# EAGLE design radiosonde_lite_final (EAGLE 9.6.2)
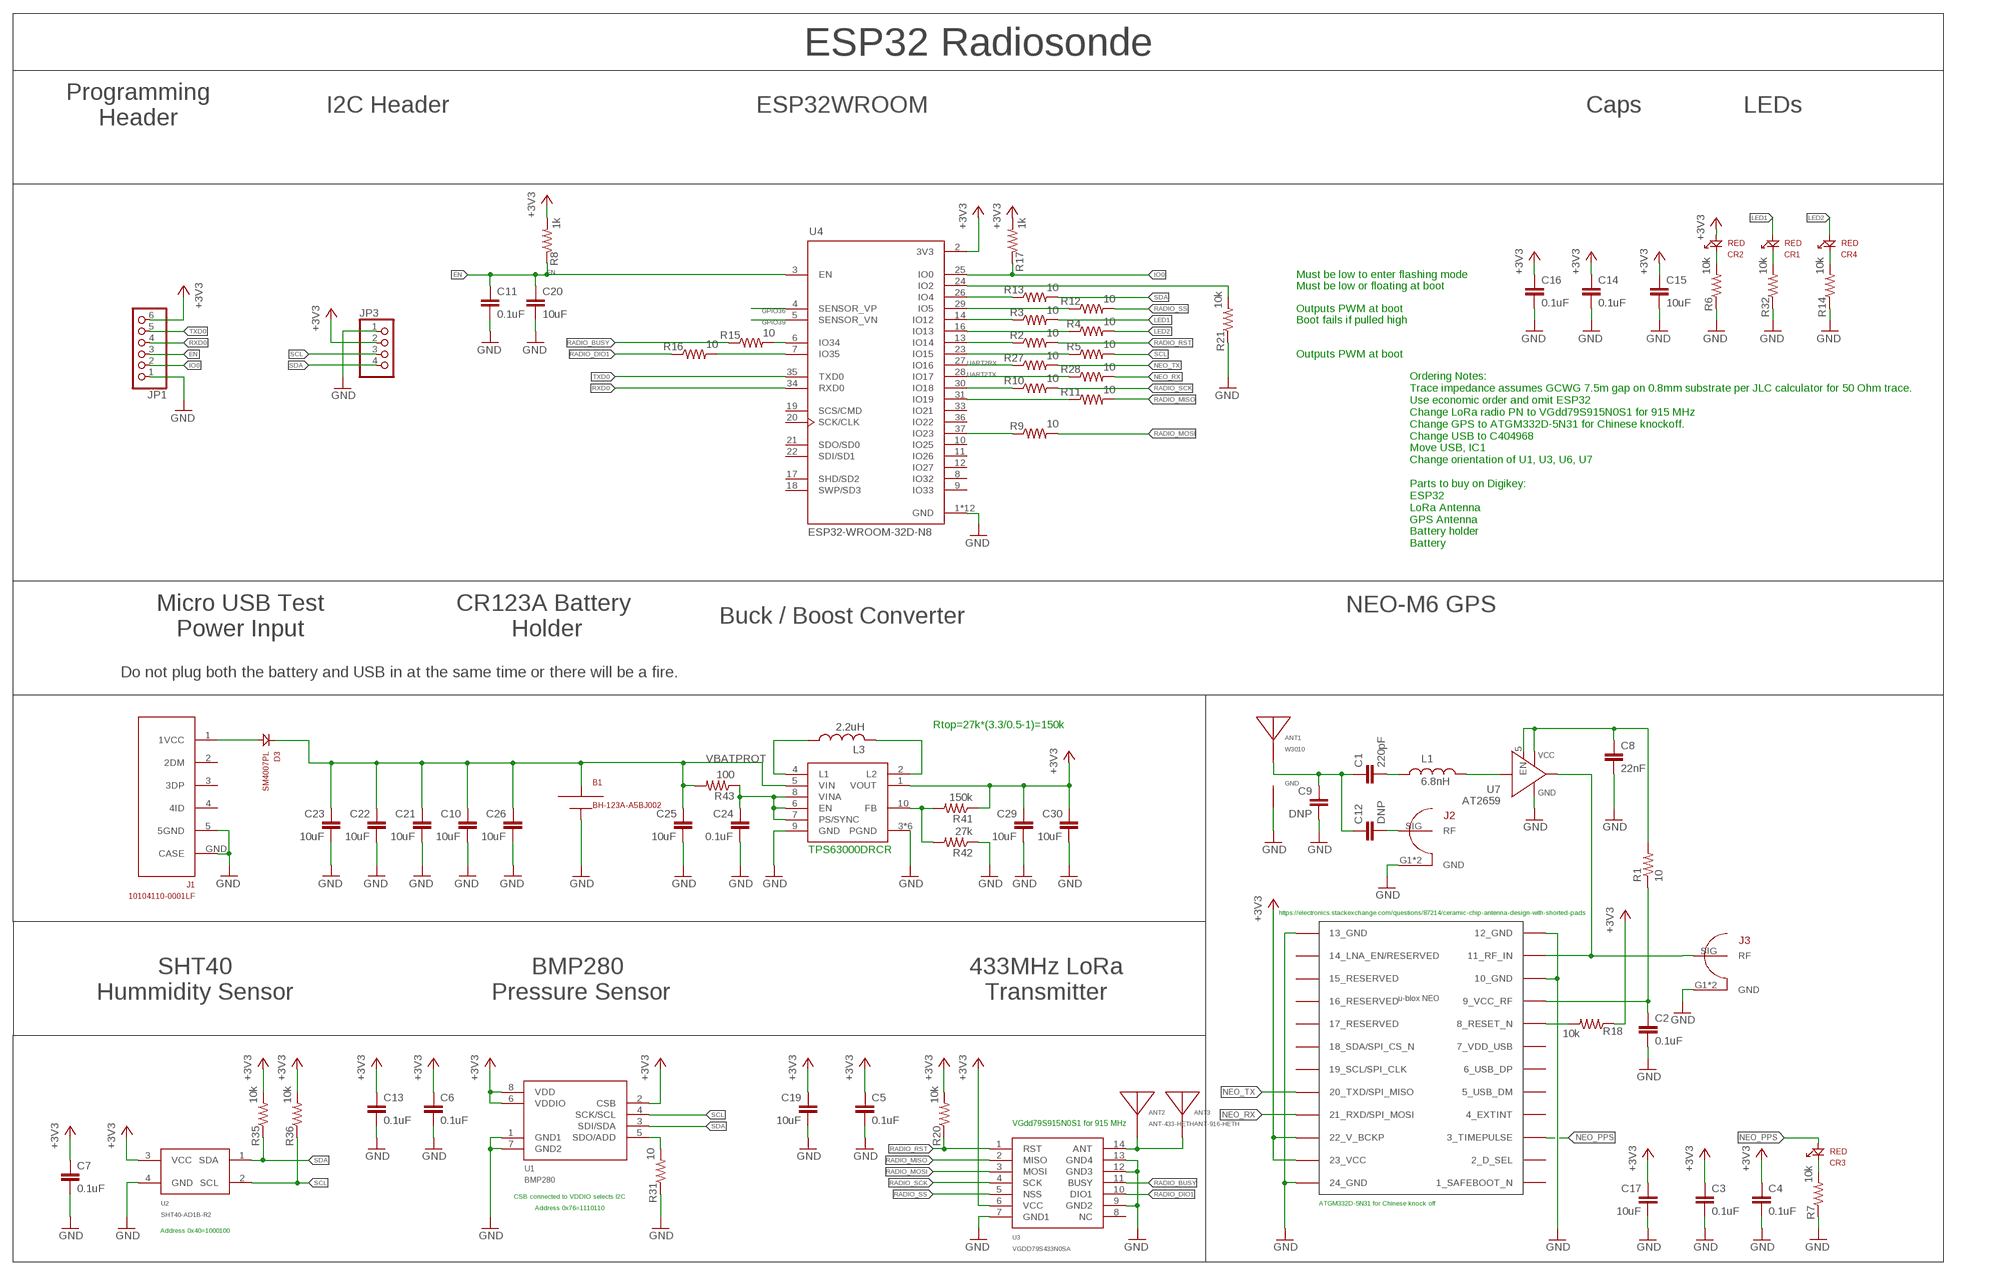
[diagram p0: schematic, sheet 1]

## Parts
ANT1  W3010  [W3010]
ANT2  ANT-433-HETH  [ANT-433-HETH]
ANT3  ANT-916-HETH  [ANT-916-HETH]
B1  BH-123A-A5BJ002  [BH-123A-A5BJ002]
C1  220pF  0402_CAPACITOR  [0402_INDUCTOR]
C2  0.1uF  0402_CAPACITOR  [0402_INDUCTOR]
C3  0.1uF  0402_CAPACITOR  [0402_INDUCTOR]
C4  0.1uF  0402_CAPACITOR  [0402_INDUCTOR]
C5  0.1uF  0402_CAPACITOR  [0402_INDUCTOR]
C6  0.1uF  0402_CAPACITOR  [0402_INDUCTOR]
C7  0.1uF  0402_CAPACITOR  [0402_INDUCTOR]
C8  22nF  0402_CAPACITOR  [0402_INDUCTOR]
C9  DNP  0402_CAPACITOR  [0402_INDUCTOR]
C10  10uF  0603_CAPACITOR  [0603]
C11  0.1uF  0402_CAPACITOR  [0402_INDUCTOR]
C12  DNP  0402_CAPACITOR  [0402_INDUCTOR]
C13  0.1uF  0402_CAPACITOR  [0402_INDUCTOR]
C14  0.1uF  0402_CAPACITOR  [0402_INDUCTOR]
C15  10uF  0603_CAPACITOR  [0603]
C16  0.1uF  0402_CAPACITOR  [0402_INDUCTOR]
C17  10uF  0603_CAPACITOR  [0603]
C19  10uF  0603_CAPACITOR  [0603]
C20  10uF  0603_CAPACITOR  [0603]
C21  10uF  0603_CAPACITOR  [0603]
C22  10uF  0603_CAPACITOR  [0603]
C23  10uF  0603_CAPACITOR  [0603]
C24  0.1uF  0603_CAPACITOR  [0603]
C25  10uF  0603_CAPACITOR  [0603]
C26  10uF  0603_CAPACITOR  [0603]
C29  10uF  0603_CAPACITOR  [0603]
C30  10uF  0603_CAPACITOR  [0603]
CR1  RED  150060RS75000  [0603_DIODE]
CR2  RED  150060RS75000  [0603_DIODE]
CR3  RED  150060RS75000  [0603_DIODE]
CR4  RED  150060RS75000  [0603_DIODE]
D3  SM4007PL  [SOD123(AK)]
IC1  NEO-M8  [NEO-M8]
J1  10104110-0001LF  [MICRO_USB]
J2  CONUFL001-SMD  [U.FL]
J3  CONUFL001-SMD  [U.FL]
JP1  PINHD-1X6  [1X06]
JP3  PINHD-1X4  [1X04]
L1  6.8nH  0402_INDUCTOR  [0402_INDUCTOR]
L3  2.2uH  CY43-2.2UH  [CY43]
R1  10  0402_RESISTOR  [R0402]
R2  10  0402_RESISTOR  [R0402]
R3  10  0402_RESISTOR  [R0402]
R4  10  0402_RESISTOR  [R0402]
R5  10  0402_RESISTOR  [R0402]
R6  10k  0402_RESISTOR  [R0402]
R7  10k  0402_RESISTOR  [R0402]
R8  1k  0402_RESISTOR  [R0402]
R9  10  0402_RESISTOR  [R0402]
R10  10  0402_RESISTOR  [R0402]
R11  10  0402_RESISTOR  [R0402]
R12  10  0402_RESISTOR  [R0402]
R13  10  0402_RESISTOR  [R0402]
R14  10k  0402_RESISTOR  [R0402]
R15  10  0402_RESISTOR  [R0402]
R16  10  0402_RESISTOR  [R0402]
R17  1k  0402_RESISTOR  [R0402]
R18  10k  0402_RESISTOR  [R0402]
R20  10k  0402_RESISTOR  [R0402]
R21  10k  0402_RESISTOR  [R0402]
R27  10  0402_RESISTOR  [R0402]
R28  10  0402_RESISTOR  [R0402]
R31  10  0402_RESISTOR  [R0402]
R32  10k  0402_RESISTOR  [R0402]
R35  10k  0402_RESISTOR  [R0402]
R36  10k  0402_RESISTOR  [R0402]
R41  150k  0603_RESISTOR  [0603]
R42  27k  0603_RESISTOR  [0603]
R43  100  0603_RESISTOR  [0603]
U1  BMP280  [BME280]
U2  SHT40-AD1B-R2  [SHT40]
U3  VGDD79S433N0SA  [VGDD79S433N0SA]
U4  ESP32-WROOM-32D-N8  ESP32-WROOM-32D  [MODULE_ESP32-WROOM-32D]
U6  TPS63000DRCR  [S-PVSON-N10]
U7  AT2659  [6DFN-1X1.6]

## Nets
+3V3: C3.P$1 C4.P$1 C5.P$1 C6.P$1 C7.P$1 C13.P$1 C14.P$1 C15.1 C16.P$1 C17.1 C19.1 C29.1 C30.1 CR2.A IC1.22(22_V_BCKP) IC1.23(23_VCC) JP1.6 JP3.2 R8.2 R17.2 R18.1 R20.2 R35.2 R36.2 R41.1 U1.2(CSB) U1.6(VDDIO) U1.8(VDD) U2.3(VCC) U3.6(VCC) U4.2(3V3) U6.1(VOUT)
EN: C11.P$1 C20.1 JP1.3 R8.1 U4.3(EN)
GND: ANT1.P$1(GND) ANT1.P$3(GND) B1.N(-) C2.P$2 C3.P$2 C4.P$2 C5.P$2 C6.P$2 C7.P$2 C8.P$2 C9.P$2 C10.2 C11.P$2 C13.P$2 C14.P$2 C15.2 C16.P$2 C17.2 C19.2 C20.2 C21.2 C22.2 C23.2 C24.2 C25.2 C26.2 C29.2 C30.2 IC1.10(10_GND) IC1.12(12_GND) IC1.13(13_GND) IC1.24(24_GND) J1.5(5GND) J1.GND(CASE) J2.G1(GND) J2.G2(GND) J3.G1(GND) J3.G2(GND) JP1.1 JP3.1 R6.1 R7.1 R14.1 R21.1 R31.1 R32.1 R42.1 U1.1(GND1) U1.7(GND2) U2.4(GND) U3.7(GND1) U3.9(GND2) U3.12(GND3) U3.13(GND4) U4.1(GND) U4.15(GND) U4.38(GND) U4.39_1(GND) U4.39_2(GND) U4.39_3(GND) U4.39_4(GND) U4.39_5(GND) U4.39_6(GND) U4.39_7(GND) U4.39_8(GND) U4.39_9(GND) U6.3(PGND) U6.9(GND) U6.PG1(PGND) U6.PG2(PGND) U6.PG3(PGND) U6.PG4(PGND) U6.PG(PGND) U7.1(GND) U7.2(GND)
GPIO36: U4.4(SENSOR_VP)
GPIO39: U4.5(SENSOR_VN)
GPS_VCC_RF: C8.P$1 R1.2 U7.4(VS) U7.5(EN)
IO0: JP1.2 R17.1 U4.25(IO0)
LED1: CR1.A R3.2
LED2: CR4.A R4.2
N$1: R3.1 U4.14(IO12)
N$2: IC1.8(8_RESET_N) R18.2
N$3: R10.1 U4.30(IO18)
N$4: C1.P$2 L1.P$1
N$5: R16.2 U4.7(IO35)
N$6: L1.P$2 U7.3(RF_IN)
N$7: CR2.K R6.2
N$8: R11.1 U4.31(IO19)
N$9: R4.1 U4.16(IO13)
N$10: R31.2 U1.5(SDO/ADD)
N$11: ANT2.IN1 ANT2.IN2 ANT3.IN1 U3.14(ANT)
N$12: CR3.K R7.2
N$13: R5.1 U4.23(IO15)
N$14: ANT1.P$2(ANT) C1.P$1 C9.P$1 C12.P$1
N$15: CR1.K R32.2
N$16: R12.1 U4.29(IO5)
N$17: R13.1 U4.26(IO4)
N$18: CR4.K R14.2
N$19: R15.2 U4.6(IO34)
N$20: R9.1 U4.37(IO23)
N$25: D3.A J1.1(1VCC)
N$26: C2.P$1 IC1.9(9_VCC_RF) R1.1
N$28: R21.2 U4.24(IO2)
N$29: R2.1 U4.13(IO14)
N$30: C12.P$2 J2.SIG(RF)
N$31: IC1.11(11_RF_IN) J3.SIG(RF) U7.6(RF_OUT)
N$44: L3.P$1 U6.4(L1)
N$47: L3.P$2 U6.2(L2)
N$48: R41.2 R42.2 U6.10(FB)
N$49: C24.1 R43.1 U6.6(EN) U6.7(PS/SYNC) U6.8(VINA)
NEO_PPS: CR3.A IC1.3(3_TIMEPULSE)
NEO_RX: IC1.21(21_RXD/SPI_MOSI) R28.2
NEO_TX: IC1.20(20_TXD/SPI_MISO) R27.2
RADIO_BUSY: R15.1 U3.11(BUSY)
RADIO_DIO1: R16.1 U3.10(DIO1)
RADIO_MISO: R11.2 U3.2(MISO)
RADIO_MOSI: R9.2 U3.3(MOSI)
RADIO_RST: R2.2 R20.1 U3.1(RST)
RADIO_SCK: R10.2 U3.4(SCK)
RADIO_SS: R12.2 U3.5(NSS)
RXD0: JP1.4 U4.34(RXD0)
SCL: JP3.3 R5.2 R36.1 U1.4(SCK/SCL) U2.2(SCL)
SDA: JP3.4 R13.2 R35.1 U1.3(SDI/SDA) U2.1(SDA)
TXD0: JP1.5 U4.35(TXD0)
UART2RX: R27.1 U4.27(IO16)
UART2TX: R28.1 U4.28(IO17)
VBATPROT: B1.P(+) C10.1 C21.1 C22.1 C23.1 C25.1 C26.1 D3.K R43.2 U6.5(VIN)
Unconnected: IC1.1(1_SAFEBOOT_N) IC1.2(2_D_SEL) IC1.4(4_EXTINT) IC1.5(5_USB_DM) IC1.6(6_USB_DP) IC1.7(7_VDD_USB) IC1.14(14_LNA_EN/RESERVED) IC1.15(15_RESERVED) IC1.16(16_RESERVED) IC1.17(17_RESERVED) IC1.18(18_SDA/SPI_CS_N) IC1.19(19_SCL/SPI_CLK) J1.2(2DM) J1.3(3DP) J1.4(4ID) U3.8(NC) U4.8(IO32) U4.9(IO33) U4.10(IO25) U4.11(IO26) U4.12(IO27) U4.17(SHD/SD2) U4.18(SWP/SD3) U4.19(SCS/CMD) U4.20(SCK/CLK) U4.21(SDO/SD0) U4.22(SDI/SD1) U4.33(IO21) U4.36(IO22)

## Notes on the sheet
- ESP32 Radiosonde
- Programming
  Header
- I2C Header | ESP32WROOM | Caps | LEDs
- Must be low to enter flashing mode
- Must be low or floating at boot
- Outputs PWM at boot
- Boot fails if pulled high
- Outputs PWM at boot
- Ordering Notes:
  Trace impedance assumes GCWG 7.5m gap on 0.8mm substrate per JLC calculator for 50 Ohm trace.
  Use economic order and omit ESP32
  Change LoRa radio PN to VGdd79S915N0S1 for 915 MHz
  Change GPS to ATGM332D-5N31 for Chinese knockoff.
  Change USB to C404968 
  Move USB, IC1
  Change orientation of U1, U3, U6, U7
  
  Parts to buy on Digikey:
  ESP32
  LoRa Antenna
  GPS Antenna
  Battery holder
  Battery
- NEO-M6 GPS
- Micro USB Test
  Power Input
- CR123A Battery 
  Holder
- Buck / Boost Converter
- Do not plug both the battery and USB in at the same time or there will be a fire.
- Rtop=27k*(3.3/0.5-1)=150k
- TPS63000DRCR
- https://electronics.stackexchange.com/questions/87214/ceramic-chip-antenna-design-with-shorted-pads
- SHT40
  Hummidity Sensor
- BMP280 
  Pressure Sensor
- 433MHz LoRa
  Transmitter
- VGdd79S915N0S1 for 915 MHz
- CSB connected to VDDIO selects I2C
- Address 0x76=1110110 | ATGM332D-5N31 for Chinese knock off
- Address 0x40=1000100

## Library data of the parts
ANT1 = ruark2:W3010: 2.8dBi Chip antenna 1.575GHz - Antennas ROHS; JLCPCB: C6926293
ANT2 = ruark2:ANT-433-HETH: 433MHz Alarms, ISM, Remote Control, Security Systems Helical RF Antenna 418MHz ~ 458MHz 1.9dBi Solder Through Hole; PARTNO: ANT-433-HETH-ND
ANT3 = ruark2:ANT-916-HETH: RF ANT 916MHZ HELICAL SLD TH
B1 = ruark2:BH-123A-A5BJ002: Battery case CR123A - Button And Strip Battery Connector ROHS; JLCPCB: C5290177
C1-C9 C11-C14 C16 = ruark2:0402_CAPACITOR: 0402 select capacitor; VALUE: sel
C10 C15 C17 C19-C26 C29 C30 = ruark2:0603_CAPACITOR: 0603 Capacitor -- WARNING: NO DEFINED VALUE OR PART NUMBER; VALUE: sel
CR1-CR4 = ruark2:150060RS75000: Red 625nm LED Indication - Discrete 2V 0603 (1608 Metric); PARTNO: 732-4978-1-ND
D3 = ruark2:SM4007PL: 1A 1kV 1.1V@1A SOD-123FL Diodes - General Purpose ROHS JLCPCB: C64898
IC1 = ubloxLib:NEO-M8: u-blox NEO GNSS module
J1 = ruark2:10104110-0001LF: USB - micro B USB 2.0 Receptacle Connector 5 Position Surface Mount, Right Angle; PARTNO: 609-4052-1-ND
J2 J3 = ruark2:CONUFL001-SMD
JP1 = pinhead:PINHD-1X6: PIN HEADER
JP3 = pinhead:PINHD-1X4: PIN HEADER
L1 = ruark2:0402_INDUCTOR: select; VALUE: SEL
L3 = ruark2a:CY43-2.2UH: 2.3A 2.2uH ±20% 42mΩ SMD,4x4.5mm Inductors (SMD) ROHS; JLCPCB: C2929416
R1-R18 R20 R21 R27 R28 R31 R32 R35 R36 = ruark2:0402_RESISTOR: 0402 Resistor -- WARNING: NO DEFINED PART NUMBER OR VALUE
R41-R43 = ruark2:0603_RESISTOR: 0603 Resistor -- WARNING: NO DEFINED PART NUMBER OR VALUE; VALUE: sel
U1 = ruark2:BMP280: Pressure Sensor 4.35PSI ~ 15.95PSI (30kPa ~ 110kPa) Absolute 16b 8-SMD; PARTNO: 828-1064-1-ND
U2 = ruark2:SHT40-AD1B-R2: Temperature and Humidity Sensor ROHS; JLCPCB: C2909890
U3 = ruark2:VGDD79S433N0SA: -118dBm 433MHz 22dBm SPI SMD,11.5x11.5mm LoRa Modules ROHS; JLCPCB: C2976576
U4 = ESP32-WROOM-32D:ESP32-WROOM-32D: Bluetooth, WiFi 802.11b/g/n, Bluetooth v4.2 + EDR, Class 1, 2 and 3 Transceiver Module 2.4GHz ~ 2.5GHz Integrated, Trace Surface Mount Check prices <https://pricing.snapeda.com/parts/ESP32-WROOM-32D/Espressif%20Systems/view-part?ref=eda>; AVAILABILITY: Bad; DESCRIPTION: Bluetooth, WiFi 802.11b/g/n, Bluetooth v4.2 +EDR, Class 1, 2 and 3 Transceiver Module 2.4GHz ~ 2.5GHz Integrated, Trace Surface Mount; MF: Espressif Systems; MP: ESP32-WROOM-32D; PACKAGE: Module Espressif Systems; PRICE: None
U6 = ruark2a:TPS63000DRCR: Buck-Boost Switching Regulator IC Positive Adjustable 1.2V 1 Output 1.6A (Switch) 10-VFDFN Exposed Pad; PARTNO: 296-19641-1-ND
U7 = ruark2:AT2659: 1.4V~3.6V 4.3mA DFN-6(1x1.6) Low Noise Amplifiers (LNA) - RF ROHS; JLCPCB: C92450

## Net classes
1 HV: clearance 0.406 mm

## Board
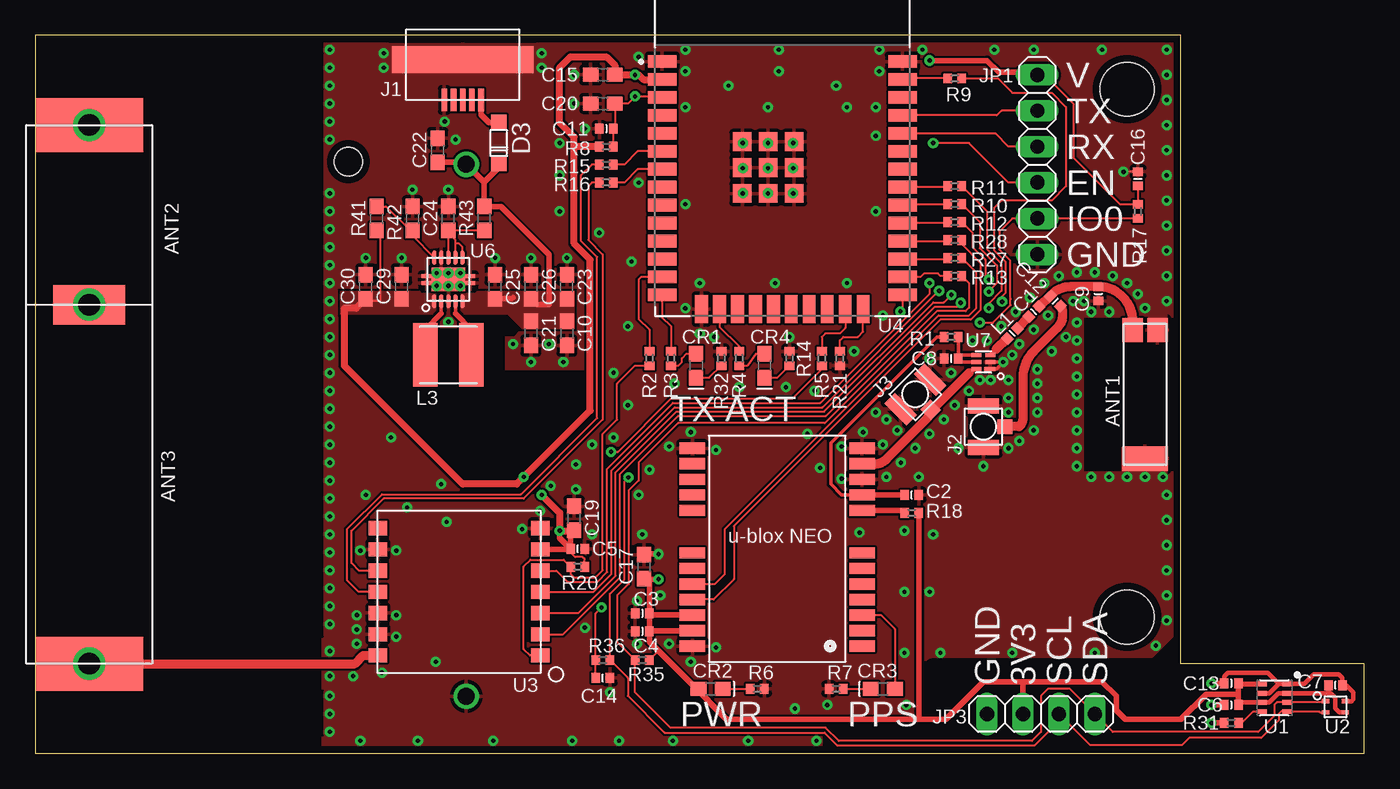
[diagram p1: board, top side]
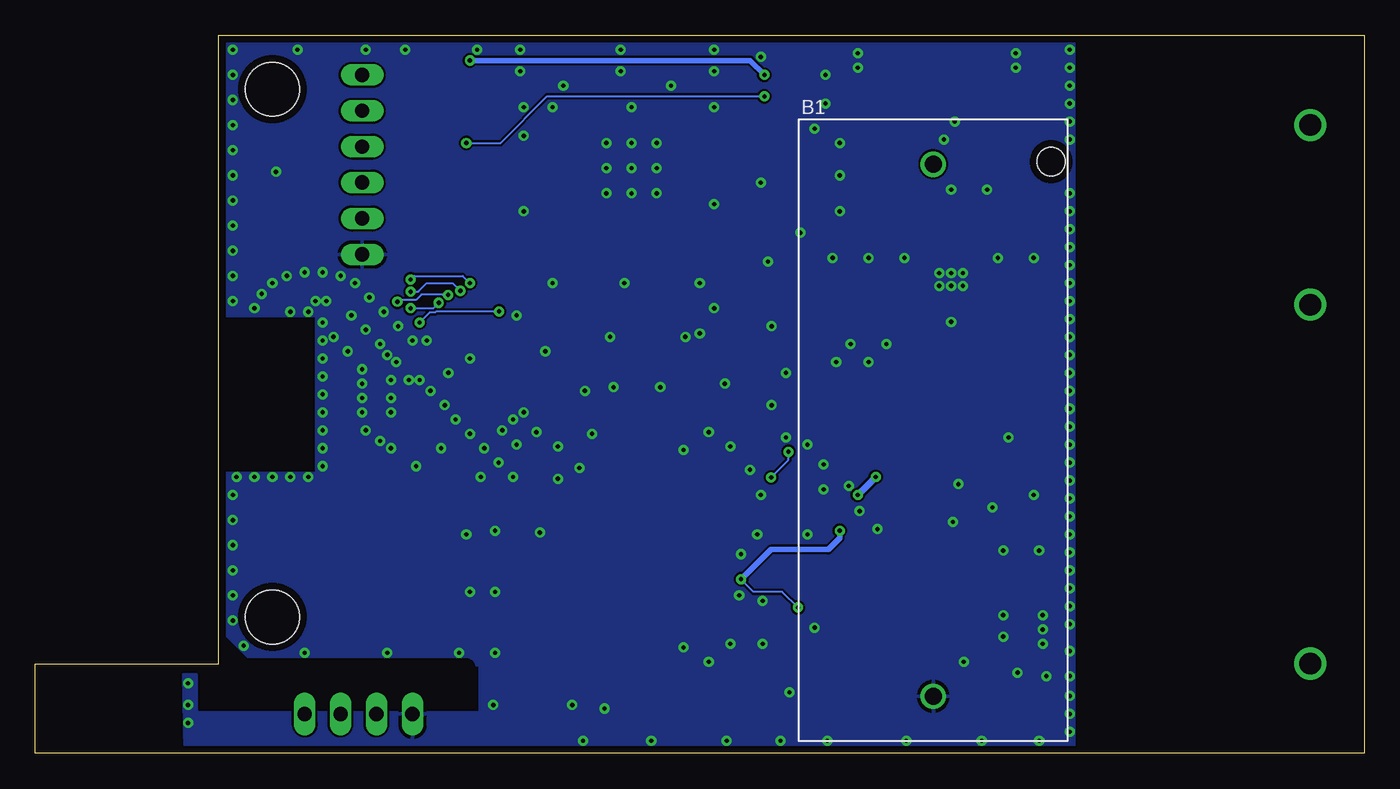
[diagram p2: board, bottom side, seen from below]

Size 93.98 x 50.8 mm. Coordinates in mm from the lower left corner, seen from the top.
Outline: 0,0 93.98,0 93.98,6.35 81.03,6.35 81.03,50.8 0,50.8 0,0
Copper layers (1*16): Top 0.035mm / dielectric 1.5mm / Bottom 0.035mm
Design rules "default *": minimum track width 6mil, minimum drill 10mil, track to track 6mil, track to pad 6mil, pad to pad 6mil, via to via 6mil, smd to smd 6mil, copper to edge 20mil, drill to drill 6mil, minimum pad ring 10mil, minimum via ring 8mil, stop-mask expansion 4mil, vias tented up to drill 12mil, thermal gap 10mil
Holes 3.81 mm at 77.22,46.99 77.22,9.65
tRestrict: area 28.7,25.9 to 29.7,30; area 61,24.4 to 63.2,26.7; area 66,22.4 to 67.8,23.9; 9 lines
bRestrict: 2 lines

### Footprints (pad centres in the part's own frame; a part is rotated, then mirrored left to right if it is on the bottom)
W3010 = smd 1.7 x 3.2: P$1 -4.55,0 | smd 1.7 x 1.45: P$2 4.55,0.875; P$3 4.55,-0.875
ANT-433-HETH = drill 1.524: IN1 -19.05,0; NC1 19.05,0 | smd 3.81 x 7.62: IN2 -19.05,0; NC2 19.05,0
ANT-916-HETH = drill 1.524: IN1 -12.7,0; NC1 12.7,0 | smd 2.794 x 5.08: IN2 -12.7,0; NC2 12.7,0
BH-123A-A5BJ002 = drill 1.2: N 18.82,0; P -18.82,0 | hole 2: -19,8.34
0402_INDUCTOR = smd 0.6 x 0.7: P$1 0.5,0; P$2 -0.5,0
0603 = smd 1.1 x 1: 1 -0.85,0; 2 0.85,0
0603_DIODE = smd 1.1 x 1: A -0.85,0; K 0.85,0
SOD123(AK) = smd 1.1 x 1.1: A 1.45,0; K -1.45,0
NEO-M8 = smd 1.8 x 0.8: 1 6.4,-7.4; 2 6.4,-6.3; 3 6.4,-5.2; 4 6.4,-4.1; 5 6.4,-3; 6 6.4,-1.9; 7 6.4,-0.8; 8 6.4,2.2; 9 6.4,3.3; 10 6.4,4.4; 11 6.4,5.5; 12 6.4,6.6; 13 -5.6,6.6; 14 -5.6,5.5; 15 -5.6,4.4; 16 -5.6,3.3; 17 -5.6,2.2; 18 -5.6,-0.8; 19 -5.6,-1.9; 20 -5.6,-3; 21 -5.6,-4.1; 22 -5.6,-5.2; 23 -5.6,-6.3; 24 -5.6,-7.4
MICRO_USB = smd 0.4 x 1.6: 1 -1.3,0; 2 -0.65,0; 3 0,0; 4 0.65,0; 5 1.3,0 | smd 10 x 1.9: GND 0,-2.84
U.FL = smd 1.05 x 2.2: G1 -1.475,0; G2 1.475,0 | smd 1 x 1.05: SIG 0,-1.525
1X06 = drill 1.016 long: 1 -6.35,0; 2 -3.81,0; 3 -1.27,0; 4 1.27,0; 5 3.81,0; 6 6.35,0
1X04 = drill 1.016 long: 1 -3.81,0; 2 -1.27,0; 3 1.27,0; 4 3.81,0
CY43 = smd 1.75 x 4.5: P$1 1.625,0; P$2 -1.625,0
R0402 = smd 0.6 x 0.7: 1 -0.5,0; 2 0.5,0
BME280 = smd 0.35 x 0.7: 1 -0.975,0.9; 2 -0.325,0.9; 3 0.325,0.9; 4 0.975,0.9; 5 0.975,-0.9; 6 0.325,-0.9; 7 -0.325,-0.9; 8 -0.975,-0.9
SHT40 = smd 0.5 x 0.3: 1 -0.7,0.4; 2 -0.7,-0.4; 3 0.7,-0.4; 4 0.7,0.4
VGDD79S433N0SA = smd 1 x 1.3: 1 -4.5,-5.75; 2 -3,-5.75; 3 -1.5,-5.75; 4 0,-5.75; 5 1.5,-5.75; 6 3,-5.75; 7 4.5,-5.75; 8 4.5,5.75; 9 3,5.75; 10 1.5,5.75; 11 0,5.75; 12 -1.5,5.75; 13 -3,5.75; 14 -4.5,5.75
MODULE_ESP32-WROOM-32D = smd 2 x 0.9: 1 -8.5,5.26; 2 -8.5,3.99; 3 -8.5,2.72; 4 -8.5,1.45; 5 -8.5,0.18; 6 -8.5,-1.09; 7 -8.5,-2.36; 8 -8.5,-3.63; 9 -8.5,-4.9; 10 -8.5,-6.17; 11 -8.5,-7.44; 12 -8.5,-8.71; 13 -8.5,-9.98; 14 -8.5,-11.25; 25 8.5,-11.25; 26 8.5,-9.98; 27 8.5,-8.71; 28 8.5,-7.44; 29 8.5,-6.17; 30 8.5,-4.9; 31 8.5,-3.63; 32 8.5,-2.36; 33 8.5,-1.09; 34 8.5,0.18; 35 8.5,1.45; 36 8.5,2.72; 37 8.5,3.99; 38 8.5,5.26 | smd 0.9 x 2: 15 -5.715,-12.25; 16 -4.445,-12.25; 17 -3.175,-12.25; 18 -1.905,-12.25; 19 -0.635,-12.25; 20 0.635,-12.25; 21 1.905,-12.25; 22 3.175,-12.25; 23 4.445,-12.25; 24 5.715,-12.25 | smd 1.33 x 1.33: 39_1 -2.835,-0.405; 39_2 -1,-0.405; 39_3 0.835,-0.405; 39_4 -2.835,-2.24; 39_5 -1,-2.24; 39_6 0.835,-2.24; 39_7 -2.835,-4.075; 39_8 -1,-4.075; 39_9 0.835,-4.075
S-PVSON-N10 = smd 0.28 x 1: 1 -1,-1.55; 2 -0.5,-1.55; 3 0,-1.55; 4 0.5,-1.55; 5 1,-1.55; 6 1,1.55; 7 0.5,1.55; 8 0,1.55; 9 -0.5,1.55; 10 -1,1.55 | smd 2.4 x 1.65: PG 0,0 | smd 0.7 x 0.28: PG1 -1.55,0.25; PG2 -1.55,-0.25; PG3 1.55,-0.25; PG4 1.55,0.25
6DFN-1X1.6 = smd 0.8 x 0.3: 1 -0.45,0.5 | smd 0.7 x 0.3: 2 -0.5,0; 3 -0.5,-0.5; 4 0.5,-0.5; 5 0.5,0; 6 0.5,0.5

### Placement (x,y rotation side)
ANT1  78.49,25.4 90 top
ANT2  3.81,25.4 90 top
ANT3  3.81,19.05 90 top
B1  30.48,22.86 270 bottom
C1  70.61,31.24 45 top
C2  61.98,18.29 180 top
C3  42.93,9.91 0 top
C4  42.93,8.64 0 top
C5  38.35,14.48 180 top
C6  84.58,3.43 0 top
C7  91.95,4.83 180 top
C8  64.77,27.94 0 top
C9  75.18,32.51 90 top
C10  37.59,29.72 270 top
C11  40.39,44.2 0 top
C12  72.14,32 135 top
C13  84.58,4.95 0 top
C14  40.13,5.33 180 top
C15  40.13,48.01 180 top
C16  77.98,40.64 270 top
C17  43.05,13.21 90 top
C19  38.1,16.64 90 top
C20  40.13,45.97 180 top
C21  35.05,29.72 270 top
C22  28.45,42.67 90 top
C23  37.59,33.02 90 top
C24  29.21,37.85 90 top
C25  32.51,33.02 90 top
C26  35.05,33.02 90 top
C29  25.91,33.02 90 top
C30  23.37,33.02 90 top
CR1  46.74,27.43 270 top
CR2  47.75,4.57 0 top
CR3  59.94,4.57 180 top
CR4  51.56,27.43 270 top
D3  32.77,43.18 90 top
IC1  52.07,14.99 0 top
J1  30.23,46.23 180 top
J2  67.06,23.11 90 top
J3  62.23,25.4 45 top
JP1  70.87,41.66 90 top
JP3  71.12,2.79 0 top
L1  69.09,29.72 45 top
L3  29.21,28.19 0 top
R1  64.77,29.46 0 top
R2  43.43,27.94 270 top
R3  44.96,27.94 270 top
R4  49.78,27.94 270 top
R5  55.63,27.94 270 top
R6  51.05,4.57 180 top
R7  56.64,4.57 0 top
R8  40.39,42.93 180 top
R9  65.02,47.75 0 top
R10  65.02,38.86 0 top
R11  65.02,40.13 0 top
R12  65.02,37.59 0 top
R13  65.02,33.78 0 top
R14  53.34,27.94 270 top
R15  40.39,41.66 0 top
R16  40.39,40.39 0 top
R17  77.98,38.35 90 top
R18  61.98,17.02 180 top
R20  38.35,13.21 0 top
R21  56.9,27.94 90 top
R27  65.02,35.05 0 top
R28  65.02,36.32 0 top
R31  84.58,2.16 0 top
R32  48.51,27.94 270 top
R35  42.93,6.6 0 top
R36  40.13,6.6 180 top
R41  24.13,37.85 90 top
R42  26.67,37.85 270 top
R43  31.75,37.85 90 top
U1  87.63,3.94 270 top
U2  91.95,3.3 0 top
U3  29.97,11.43 90 top
U4  52.83,43.69 0 top
U6  29.21,33.53 0 top
U7  67.06,27.69 180 top

### Tracks (layer width: path | path; a pad name or v marks a point on that pad's centre or on a via)
+3V3  (via drill 0.3)
  Top 0.152: C4.P$1 43.56,8.64 | R41.1 24.38,36.74 24.38,32 23.53,32 C30.1 | 42.67,48.01 v42.42,48.01 | CR2.A 46.74,4.57 46.35,4.95 | R20.2 38.85,13.71 38.86,13.72 38.68,13.9 38.17,13.9 37.81,14.26 37.81,14.43 | R35.2 44.06,7.24 44.07,7.24 | v40.05,10.32 39.63,9.9 R36.2 C14.P$1 | JP1.6 71.37,48.01 73.41,45.97 73.41,42.16 76.72,38.85 R17.2 C16.P$1
  Top 0.305: C6.P$1 85.27,3.61 U1.6 87.27,3.61 87.92,4.26 U1.2 91.44,4.26 | 91.44,4.26 91.62,4.26 91.95,3.94 91.95,3.17 92.22,2.9 U2.3 | C7.P$1 91.45,4.27 91.44,4.26
  Top 0.356: C13.P$1 85.12,4.91 U1.8
  Top 0.406: C13.P$1 85.08,4.19 | 85.08,4.19 C6.P$1 | IC1.22 43.55,9.79 C3.P$1 | IC1.23 43.61,8.69 43.56,8.64 | C3.P$1 C4.P$1 43.43,7.88 44.07,7.24 46.35,4.95 48.9,2.41 62.48,2.41 | C3.P$1 43.43,11.98 C17.1 43.09,12.32 v44.07,12.32 | 85.08,4.19 82.8,4.19 81.03,2.41 77.09,2.41 76.45,3.05 76.45,4.06 75.44,5.08 69.85,5.08 | C5.P$1 37.81,14.43 U3.6 | C19.1 37.85,15.54 C5.P$1 | R18.1 62.48,2.41 | C5.P$1 37.08,15.25 v37.08,15.75 | JP1.6 70.08,48.01 69.9,48.18 68.15,48.18 67.31,49.02 v63.25,49.02 | 62.48,2.41 64.39,2.41 67.06,5.08 69.85,5.08 | JP3.2 69.85,5.08
  Top 0.508: C30.1 22.69,31.5 21.84,31.5 21.84,27.43 30.23,19.05 34.04,19.05 v34.54,19.56 39.24,24.26 39.24,34.92 38.1,36.07 38.1,42.93 | v35.81,18.29 37.08,17.02 v37.08,15.75 38.06,15.75 C19.1 | U4.2 43,47.68 42.67,48.01 | v42.42,48.01 C15.1 40.98,48.68 40.39,49.28 37.85,49.28 37.08,48.51 37.08,44.62 38.1,43.6 38.1,42.93 | R8.2 38.1,42.93
  Bottom 0.152: v40.05,10.32 41.16,11.43 43.18,11.43 v44.07,12.32
  Bottom 0.406: v44.07,12.32 41.96,14.43 37.89,14.43 37.08,15.24 v37.08,15.75 | v42.42,48.01 43.43,49.02 v63.25,49.02
  Bottom 0.508: v34.54,19.56 v35.81,18.29
  pour Top (no thermals): 28.32,32.51 27.3,32.51 27.18,32.64 21.59,32.64 21.59,31.11 28.07,31.11 28.32,31.37
EN  (via drill 0.3)
  Top 0.152: U4.3 44.26,46.48 v42.42,46.48 41.91,45.97 C20.1 40.98,44.29 C11.P$1 R8.1 | v63.5,43.18 66.04,43.18 68.83,40.39 JP1.3
  Bottom 0.152: v63.5,43.18 61.09,43.18 57.78,46.48 v42.42,46.48
GND  (via drill 0.3)
  Top 0.152: C16.P$2 v76.97,41.14 v76.96,41.15
  Top 0.254: U7.2 v68.45,27.69 67.95,27.19 U7.1
  Top 0.305: U1.7 87.28,4.26 87.93,4.91 | 87.93,4.91 U1.1 89.75,4.91 90.42,5.59 92.2,5.59 92.45,5.34 C7.P$2 92.71,4.83 93.22,4.32 93.22,3.81 93.11,3.7 U2.4 | C13.P$2 84.08,5.44 84.33,5.69 87.15,5.69 87.93,4.91
  Top 0.406: R31.1 v83.19,2.16 | C6.P$2 v83.19,3.43 | C13.P$2 v83.19,4.95 | C17.2 43.09,14.1 v44.07,14.1
  other vias: 75.95,31.24 74.68,31.24 73.66,30.48 73.66,29.21 73.66,27.94 73.66,26.67 73.66,25.4 73.66,24.13 73.66,22.86 73.66,21.59 73.66,20.32 74.68,19.56 75.95,19.56 77.22,19.56 78.49,19.56 79.76,19.56 20.83,7.24 20.83,5.46 78.49,31.5 77.98,32.51 77.22,33.27 76.2,33.78 74.93,34.04 73.66,34.04 72.39,33.78 71.37,33.27 70.36,32.26 69.34,31.24 68.33,30.23 67.31,29.21 69.6,28.96 70.61,29.97 71.63,30.99 73.41,32 74.17,32 72.9,29.46 71.88,28.45 70.87,27.18 69.09,28.19 68.83,26.42 68.83,24.13 68.83,25.15 70.87,25.15 70.87,26.16 70.87,24.13 68.83,21.59 65.28,21.59 67.06,20.32 67.56,26.42 66.04,25.65 66.8,26.42 65.02,24.64 64.26,23.62 63.25,22.61 62.23,21.59 61.21,20.57 60.2,19.56 60.96,22.86 59.94,21.84 64.77,26.92 63.25,27.94 59.44,24.13 60.2,23.62 69.6,22.1 70.61,22.86 48.13,21.46 46.35,22.73 44.83,21.72 44.83,7.75 46.35,6.48 48.13,7.49 58.55,22.73 57.02,19.43 57.02,21.72 35.69,17.14 34.42,15.88 22.73,7.75 22.48,5.46 24.51,5.71 25.53,8.26 25.53,9.78 22.73,9.78 22.73,8.76 22.99,14.35 25.53,14.35 28.37,33.99 28.37,33.07 30.05,33.99 30.05,33.07 29.21,33.99 29.21,33.07 25.91,35.05 23.37,35.05 26.67,39.88 29.21,39.88 32.51,35.05 35.05,35.05 37.59,35.05 29.21,30.53 20.83,49.78 20.83,48.51 20.83,47.24 20.83,45.97 20.83,44.7 20.83,43.43 20.83,39.62 20.83,38.35 20.83,37.08 20.83,35.81 20.83,34.54 20.83,33.27 20.83,32 20.83,30.73 20.83,29.46 20.83,28.19 20.83,26.92 20.83,25.65 20.83,24.38 20.83,23.11 20.83,21.84 20.83,20.57 20.83,19.3 20.83,18.03 20.83,16.76 20.83,10.41 20.83,9.14 20.83,4.06 20.83,2.79 20.83,1.52 36.45,18.92 38.23,18.67 42.55,10.79 42.55,7.75 26.29,17.4 29.08,16.38 28.32,6.48 38.1,45.97 38.86,44.2 50.04,43.18 51.82,43.18 53.59,43.18 53.59,41.4 53.59,39.62 51.82,39.62 51.82,41.4 50.04,41.4 50.04,39.62 41.91,24.64 41.91,30.23 25.15,22.35 38.1,48.01 38.23,20.45 42.67,49.28 45.97,48.26 45.97,49.78 59.69,49.78 59.69,48.26 62.74,49.78 67.82,49.78 46.99,29.72 46.99,33.27 45.97,31.5 20.83,15.49 20.83,14.22 20.83,12.95 20.83,11.68 55.24,0.89 53.72,3.17 56.01,3.43 61.59,3.43 55.5,20.19 58.29,15.62 36.32,28.96 33.78,28.96 35.05,27.69 37.34,27.69 35.81,49.53 35.81,48.51 24.64,49.53 24.64,48.51 28.96,44.7 29.72,43.43 80.01,16.51 80.01,14.73 80.01,12.95 74.93,7.11 64.01,7.11 69.09,7.11 80.01,18.29 80.01,32 80.01,33.78 80.01,35.56 80.01,37.34 80.01,39.12 80.01,40.89 80.01,42.67 80.01,44.45 80.01,46.23 80.01,48.01 80.01,49.78 80.01,11.18 80.01,9.4 79.25,7.62 75.44,49.78 70.61,49.78 28.7,19.05 23.37,18.29 66.29,29.21 54.61,22.61 55.12,25.65 53.09,25.91 53.34,29.46 57.91,28.45 59.94,30.99 49.78,25.91 45.21,26.16 48.01,29.46 40.89,26.92 39.37,21.84 40.89,22.35 43.43,20.07 42.67,18.29 42.93,15.49 39.37,15.49 38.86,8.89 44.2,11.18 40.64,4.32 45.09,0.89 37.97,0.89 32.38,0.89 27.05,0.89 22.99,0.89 50.42,0.89 41.27,0.89 61.47,15.75 62.48,19.56 63.5,15.49 42.67,40.39 37.08,43.18 52.58,49.78 52.58,48.26 57.4,45.72 45.97,45.72 49.02,47.24 51.82,45.72 56.64,47.24 59.44,43.69 59.44,45.72 45.97,38.86 59.44,38.35 57.4,33.27 52.32,33.27 39.88,36.83 42.16,34.8 37.08,38.35 37.08,40.89 61.47,11.43 63.25,11.43 61.47,7.11
  pour Top (rank 3): 80.9,50.67 81.03,7.11 81.03,6.1 62.48,6.1 62.48,0.12 61.59,0.12 20.32,0.04 20.32,8.13 20.45,50.55
  pour Bottom: 20.57,50.67 80.9,50.67 80.9,6.22 62.61,6.22 62.61,2.92 82.42,2.92 82.55,3.05 82.55,5.59 83.57,5.59 83.44,0.13 20.45,0.13 20.45,50.55
  pour Top (no thermals): 80.01,29.21 80.01,31.5 78.23,31.5 78.23,30.99 78.74,30.99 78.74,29.21
  pour Top (no thermals): 80.01,19.3 80.01,21.59 76.45,21.59 76.45,19.3
  pour Top (no thermals): 24.38,50.29 24.38,47.75 36.32,47.75 36.32,50.29
GPS_VCC_RF
  Top 0.254: R1.2 C8.P$1 | U7.4 65.52,28.19 C8.P$1 | U7.5 65.52,27.69 C8.P$1
IO0  (via drill 0.3)
  Top 0.152: U4.25 61.33,31.42 v61.18,31.27 | R17.1 JP1.2 69.09,37.85 68.17,36.93 68.17,35.66 68.94,34.9 68.94,32.22 68.96,32.19 68.96,32.13 68.96,31.75 68.96,31.71 67.73,30.48 v66.8,30.48
  Bottom 0.152: v61.18,31.27 65.62,31.27 65.7,31.19 66.09,31.19 v66.8,30.48
LED1
  Top 0.152: R3.2 45.47,27.44 45.72,27.69 45.72,27.94 46.06,28.28 CR1.A
LED2
  Top 0.152: R4.2 50.37,27.44 50.95,28.28 CR4.A
N$1
  Top 0.152: U4.14 44.33,30.85 44.96,30.23 R3.1
N$2
  Top 0.406: IC1.8 61.07,17.19 arc-45 R18.2
N$3
  Top 0.152: U4.30 61.41,38.86 R10.1
N$4
  Top 0.645: C1.P$2 L1.P$1
N$5
  Top 0.152: U4.7 42.6,41.33 41.66,40.39 R16.2
N$6
  Top 0.305: U7.3 67.94,28.57
  Top 0.645: L1.P$2 67.94,28.57
N$7
  Top 0.152: CR2.K R6.2
N$8
  Top 0.152: R11.1 64.45,40.06 U4.31
N$9
  Top 0.152: U4.16 48.39,30.17 49.78,28.77 R4.1
N$10
  Top 0.152: R31.2 85.34,2.16 86.15,2.96 U1.5
N$11
  Top 0.645: ANT3.IN1 22.61,6.35 23.19,6.93 U3.14
N$12
  Top 0.152: R7.2 CR3.K
N$13
  Top 0.152: U4.23 57.28,30.1 56.9,29.72 55.88,29.72 55.63,29.46 R5.1
N$14
  Top 0.254: C9.P$1
  Top 0.645: ANT1.P$2 77.61,30.59 arc90 C9.P$1 73.15,33.02 arc45 71.94,32.52 C12.P$1 71.06,31.63 arc-45 C1.P$1
N$15
  Top 0.152: CR1.K 47.66,26.58 R32.2
N$16
  Top 0.152: R12.1 64.45,37.52 U4.29
N$17
  Top 0.152: R13.1 64.02,33.78 63.84,33.96 62.86,33.96 62.6,33.71 U4.26
N$18
  Top 0.152: CR4.K 52.48,26.58 R14.2
N$19
  Top 0.152: U4.6 42.6,42.6 41.66,41.66 R15.2
N$20
  Top 0.152: R9.1 61.41,47.75 U4.37
N$25
  Top 0.406: J1.1 31.53,45.18 32.08,44.63 D3.A
N$26
  Top 0.254: IC1.9 57.02,18.29 56.26,19.05 56.26,21.97 63.75,29.46 R1.1
  Top 0.406: C2.P$1 IC1.9 arc45 IC1.9
N$28
  Top 0.152: R21.2 56.9,29.21 57.15,29.46 58.17,29.46 58.55,29.84 U4.24
N$29
  Top 0.152: U4.13 42.85,33.71 42.67,33.53 42.67,30.73 43.43,29.97 R2.1
N$30
  Top 0.645: C12.P$2 arc-45 72.64,31.28 72.64,30.99 arc-45 72.28,30.12 70.59,28.43 arc45 69.85,26.63 69.85,23.73 arc-45 69.6,23.11 J2.SIG
N$31
  Top 0.305: U7.6 arc45 66.12,27.01 66.04,26.92
  Top 0.645: IC1.11 59.37,20.49 arc45 60.2,20.83 63.04,23.67 arc45 63.22,24.1 arc45 J3.SIG arc45 63.53,24.41 66.04,26.92
N$44
  Top 0.254: U6.4 29.71,31.12 | 30.84,30 L3.P$1
  Top 0.406: 29.71,31.12 30.84,30
N$47
  Top 0.254: U6.2 28.71,31.12 | 27.59,30 L3.P$2
  Top 0.406: 28.71,31.12 27.59,30
N$48
  Top 0.152: U6.10 26.67,36.62 26.67,36.83 | 26.67,36.83 R42.2 | R41.2 24.8,38.7 26.67,36.83
N$49
  Top 0.152: U6.8 29.21,36.83 | 29.21,36.83 C24.1 R43.1 | U6.7 29.71,36.07 | 29.71,36.07 29.71,36.33 29.21,36.83 | U6.6 30.21,35.82 29.96,36.07 29.71,36.07
NEO_PPS
  Top 0.152: IC1.3 59.81,9.79 60.79,8.8 CR3.A
NEO_RX
  Top 0.152: R28.2 65.52,36.02 66.85,34.7 66.85,31.37 66.17,30.68 64.01,30.68 49.4,16.08 49.4,12.32 47.97,10.89 IC1.21
NEO_TX
  Top 0.152: IC1.20 48.05,11.99 48.77,12.7 48.77,15.88 63.88,30.99 66.04,30.99 66.55,31.5 66.55,34.03 R27.2
RADIO_BUSY
  Top 0.152: U3.11 22.86,11.43 22.05,12.24 22.05,15.87 24.51,18.34 34.34,18.34 39.73,23.72 39.73,35.12 38.61,36.24 38.61,40.89 39.37,41.66 R15.1
RADIO_DIO1
  Top 0.152: U3.10 22.88,12.93 22.35,13.46 22.35,15.75 24.64,18.03 34.54,18.03 40.13,23.62 40.13,35.31 39.12,36.32 39.12,40.13 39.37,40.39 R16.1
RADIO_MISO  (via drill 0.3)
  Top 0.152: U3.2 37.33,8.43 41.35,12.45 41.35,19.76 45.47,23.88 55.91,23.88 63.63,31.6 65.17,31.6 v65.45,31.88 | v67.44,31.5 67.44,31.84 68.33,32.73 68.33,34.64 67.3,35.67 67.3,38.35 R11.2
  Bottom 0.152: v67.44,31.5 65.83,31.5 v65.45,31.88
RADIO_MOSI  (via drill 0.3)
  Top 0.152: U3.3 38.4,9.93 41.05,12.57 41.05,19.89 45.34,24.18 55.78,24.18 63.5,31.9 64.25,31.9 v64.78,32.44 | R9.2 68.07,47.75 69.09,46.74 71.88,46.74 72.9,45.72 72.9,40.13 71.88,39.12 68.33,39.12 67.82,38.61 67.82,35.58 68.63,34.77 68.63,32.6 68.38,32.35 v68.38,31.95
  Bottom 0.152: v64.78,32.44 65.18,32.44 65.21,32.46 66.68,32.46 67.06,32.08 68.25,32.08 v68.38,31.95
RADIO_RST
  Top 0.152: U3.1 34.98,6.93 34.54,7.37 34.54,13.22 35.02,13.7 37.36,13.7 R20.1 37.85,12.69 38.1,12.45 39.62,12.45 40.13,12.95 40.13,22.61 41.15,23.62 41.15,26.16 42.43,27.44 R2.2
RADIO_SCK  (via drill 0.3)
  Top 0.152: U3.4 39.47,11.43 40.74,12.7 40.74,20.01 45.21,24.49 55.65,24.49 63.9,32.73 v63.92,32.73 | R10.2 66.79,37.59 66.79,35.74 68.02,34.52 68.02,33.29 67.44,32.7 v67.44,32.66
  Bottom 0.152: v67.44,32.66 66.9,32.66 66.29,33.27 64.47,33.27 v63.92,32.73
RADIO_SS  (via drill 0.3)
  Top 0.152: U3.5 36.85,12.93 37.64,12.14 39.75,12.14 40.44,12.83 40.44,20.14 45.09,24.79 55.52,24.79 63.25,32.51 v63.25,33.27 | v67.44,33.53 67.18,33.78 67.18,34.92 66.29,35.82 66.29,36.83 R12.2
  Bottom 0.152: v67.44,33.53 67.18,33.78 63.75,33.78 v63.25,33.27
RXD0
  Top 0.152: U4.34 67.89,43.87 68.83,42.93 JP1.4
SCL  (via drill 0.3)
  Top 0.152: U2.2 90.87,2.9 90.81,2.96 U1.4 88.1,2.96 87.94,2.79 87.94,2.34 86.69,1.09 81.61,1.09 81.1,0.58 74.6,0.58 JP3.3 72.39,2.29 70.69,0.58 56.71,0.58 55.82,1.47 44.5,1.47 41.9,4.07 41.9,5.33 R36.1 40.63,11.3 41.66,12.32 41.66,19.24 v41.94,19.53 | v40.72,21.34 41.2,21.34 44.96,25.09 53.54,25.09 55.63,27.18 R5.2
  Bottom 0.152: v41.94,19.53 40.72,20.75 v40.72,21.34
SDA
  Top 0.152: U2.1 91.16,3.61 U1.3 87.81,3.61 87.63,3.43 87.63,2.67 86.49,1.52 76.2,1.52 JP3.4 73.15,4.57 71.63,4.57 71.12,4.06 71.12,1.52 70.48,0.89 56.83,0.89 55.89,1.83 44.91,1.83 42.43,4.31 R35.1 41.15,7.88 41.15,11.18 41.96,11.99 41.96,18.59 42.67,19.3 42.67,20.57 45.47,23.37 55.83,23.37 63.76,31.29 65.79,31.29 66.03,31.54 66.03,33.27 R13.2
TXD0
  Top 0.152: JP1.5 68.33,45.47 68,45.14 U4.35
UART2RX
  Top 0.152: U4.27 64.45,34.98 R27.1
UART2TX
  Top 0.152: U4.28 64.45,36.25 R28.1
VBATPROT
  Top 0.406: 33.78,32.26 33.69,32.17 C25.1 | C22.1 30.34,41.82 B1.P 31.75,40.41 | 31.75,40.41 R43.2 32.93,38.7 36.32,35.31 36.32,31.75 35.47,31.75 C26.1 | D3.K 32.77,41.43 31.75,40.41
  pour Top (rank 2, no thermals): 30.1,32.51 30.1,31.37 30.35,31.11 33.4,31.11 34.42,30.1 38.1,30.1 38.1,32.64 31.24,32.64 31.11,32.51

### Text on the board
tPlace: V | TX | RX | EN | IO0 | GND | TX | ACT | GND | 3V3 | SCL | SDA | PWR | PPS
tStop: Radiosonde V1